# EAGLE design Power Board V3 (EAGLE 7.6.0)
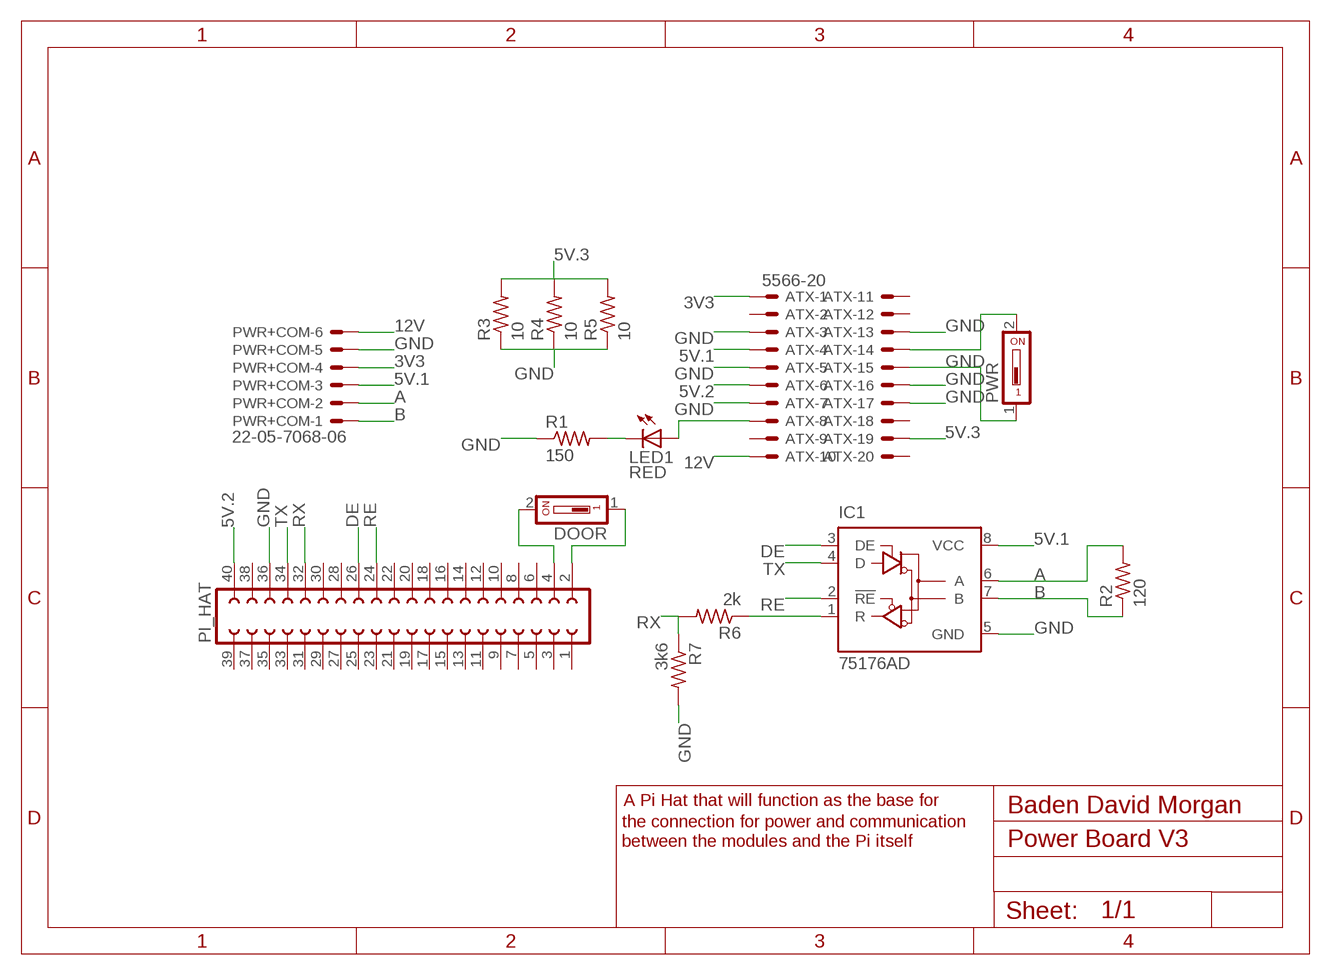
[diagram p0: schematic, sheet 1]

## Parts
ATX  5566-20  [5566-20]
DOOR  SD4-01  [SD4-01]
IC1  75176AD  [D_R-PDSO-G8]
LED1  RED  LEDCHIPLED_1206  [CHIPLED_1206]
PI_HAT  FE20-2  [FE20-2]
PWR  SD4-01  [SD4-01]
PWR+COM  22-05-7068-06  [7395-06]
R1  150  R-US_R0805  [R0805]
R2  120  R-US_R0805  [R0805]
R3  10  R-US_0817/7V  [P0817V]
R4  10  R-US_0817/7V  [P0817V]
R5  10  R-US_0817/7V  [P0817V]
R6  2k  R-US_R0805  [R0805]
R7  3k6  R-US_R0805  [R0805]

## Nets
3V3: ATX.1 PWR+COM.4
5V.1: ATX.4 IC1.8(VCC) PWR+COM.3
5V.2: ATX.6 PI_HAT.40
5V.3: ATX.19 R3.2 R4.2 R5.2
12V: ATX.10 PWR+COM.6
A: IC1.6(A) PWR+COM.2 R2.2
B: IC1.7(B) PWR+COM.1 R2.1
DE: IC1.3(DE) PI_HAT.26
GND: ATX.3 ATX.5 ATX.7 ATX.13 ATX.15 ATX.16 ATX.17 IC1.5(GND) PI_HAT.36 PWR+COM.5 PWR.1 R1.1 R3.1 R4.1 R5.1 R7.2
N$1: ATX.14 PWR.2
N$2: DOOR.2 PI_HAT.4
N$3: ATX.8 LED1.A
N$4: LED1.C R1.2
N$5: DOOR.1 PI_HAT.2
N$6: IC1.1(R) R6.1
RE: IC1.2(!RE) PI_HAT.24
RX: PI_HAT.32 R6.2 R7.1
TX: IC1.4(D) PI_HAT.34
Unconnected: ATX.2 ATX.9 ATX.11 ATX.12 ATX.18 ATX.20 PI_HAT.1 PI_HAT.3 PI_HAT.5 PI_HAT.6 PI_HAT.7 PI_HAT.8 PI_HAT.9 PI_HAT.10 PI_HAT.11 PI_HAT.12 PI_HAT.13 PI_HAT.14 PI_HAT.15 PI_HAT.16 PI_HAT.17 PI_HAT.18 PI_HAT.19 PI_HAT.20 PI_HAT.21 PI_HAT.22 PI_HAT.23 PI_HAT.25 PI_HAT.27 PI_HAT.28 PI_HAT.29 PI_HAT.30 PI_HAT.31 PI_HAT.33 PI_HAT.35 PI_HAT.37 PI_HAT.38 PI_HAT.39

## Notes on the sheet
- A Pi Hat that will function as the base for
- Baden David Morgan
- the connection for power and communication
- between the modules and the Pi itself

## Library data of the parts
ATX = con-molex:5566-20: Mini FIT connector 20 pol ATX PC-Motherboard Power connector Source: http://www.molex.com; OC_FARNELL: unknown; OC_NEWARK: unknown
DOOR PWR = switch-dil:SD4-01: DIL/CODE SWITCH; OC_FARNELL: unknown; OC_NEWARK: unknown
IC1 = 751xx:75176A: DIFFERENTIAL BUS TRANSCEIVER Source: http://focus.ti.com/lit/ds/symlink/sn75176a.pdf
LED1 = led:LED: LED OSRAM: - CHIPLED LG R971, LG N971, LY N971, LG Q971, LY Q971, LO R971, LY R971 LH N974, LH R974 LS Q976, LO Q976, LY Q976 LO Q996 - Hyper CHIPLED LW Q18S LB Q993, LB Q99A, LB R99A - SideLED LS A670, LO A670, LY A670, LG A670, LP A670 LB A673, LV A673, LT A673, LW A673 LH A674 LY A675 LS A676, LA A676, LO A676, LY A676, LW A676 LS A679, LY A679, LG A679 - Hyper Micro SIDELED® LS Y876, LA Y876, LO Y876, LY Y876 LT Y87S - SmartLED LW L88C, LW L88S LB L89C, LB L89S, LG L890 LS L89K, LO L89K, LY L89K LS L896, LA L896, LO L896, LY L896 - TOPLED LS T670, LO T670, LY T670, LG T670, LP T670 LSG T670, LSP T670, LSY T670, LOP T670, LYG T670 LG T671, LOG T671, LSG T671 LB T673, LV T673, LT T673, LW T673 LH T674 LS T676, LA T676, LO T676, LY T676, LB T676, LH T676, LSB T676, LW T676 LB T67C, LV T67C, LT T67C, LS T67K, LO T67K, LY T67K, LW E67C LS E67B, LA E67B, LO E67B, LY E67B, LB E67C, LV E67C, LT E67C LW T67C LS T679, LY T679, LG T679 LS T770, LO T770, LY T770, LG T770, LP T770 LB T773, LV T773, LT T773, LW T773 LH T774 LS E675, LA E675, LY E675, LS T675 LS T776, LA T776, LO T776, LY T776, LB T776 LHGB T686 LT T68C, LB T68C - Hyper Mini TOPLED® LB M676 - Mini TOPLED Santana® LG M470 LS M47K, LO M47K, LY M47K Source: http://www.osram.convergy.de LUXEON: - LUMILED® LXK2-PW12-R00, LXK2-PW12-S00, LXK2-PW14-U00, LXK2-PW14-V00 LXK2-PM12-R00, LXK2-PM12-S00, LXK2-PM14-U00 LXK2-PE12-Q00, LXK2-PE12-R00, LXK2-PE12-S00, LXK2-PE14-T00, LXK2-PE14-U00 LXK2-PB12-K00, LXK2-PB12-L00, LXK2-PB12-M00, LXK2-PB14-N00, LXK2-PB14-P00, LXK2-PB14-Q00 LXK2-PR12-L00, LXK2-PR12-M00, LXK2-PR14-Q00, LXK2-PR14-R00 LXK2-PD12-Q00, LXK2-PD12-R00, LXK2-PD12-S00 LXK2-PH12-R00, LXK2-PH12-S00 LXK2-PL12-P00, LXK2-PL12-Q00, LXK2-PL12-R00 Source: www.luxeon.com KINGBRIGHT: KA-3528ASYC Source: www.kingbright.com
PI_HAT = con-lsta:FE20-2: FEMALE HEADER; OC_FARNELL: unknown; OC_NEWARK: unknown
PWR+COM = con-molex:22-?-06: CONNECTOR wire to board 2.54 mm (.1 inch) pitch header; OC_FARNELL: unknown; OC_NEWARK: unknown
R1 R2 R6 R7 = resistor:R-US_: RESISTOR, American symbol
R3-R5 = rcl:R-US_: RESISTOR, American symbol

## Board
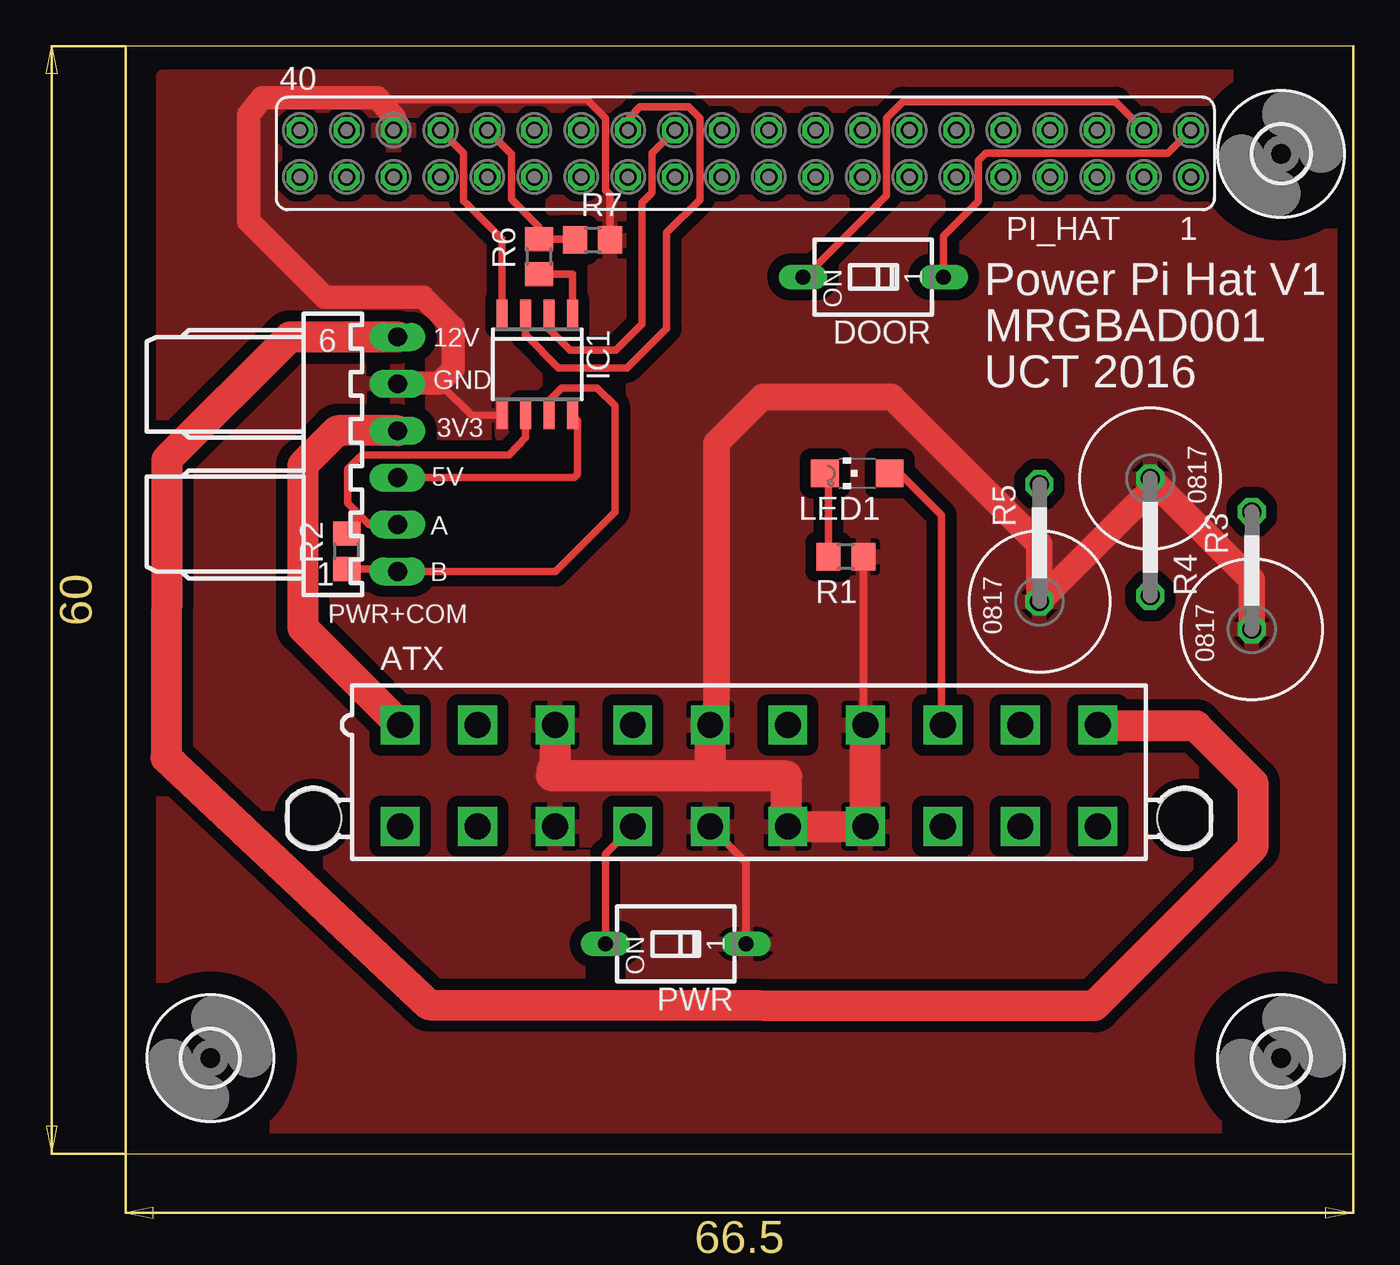
[diagram p1: board, top side]
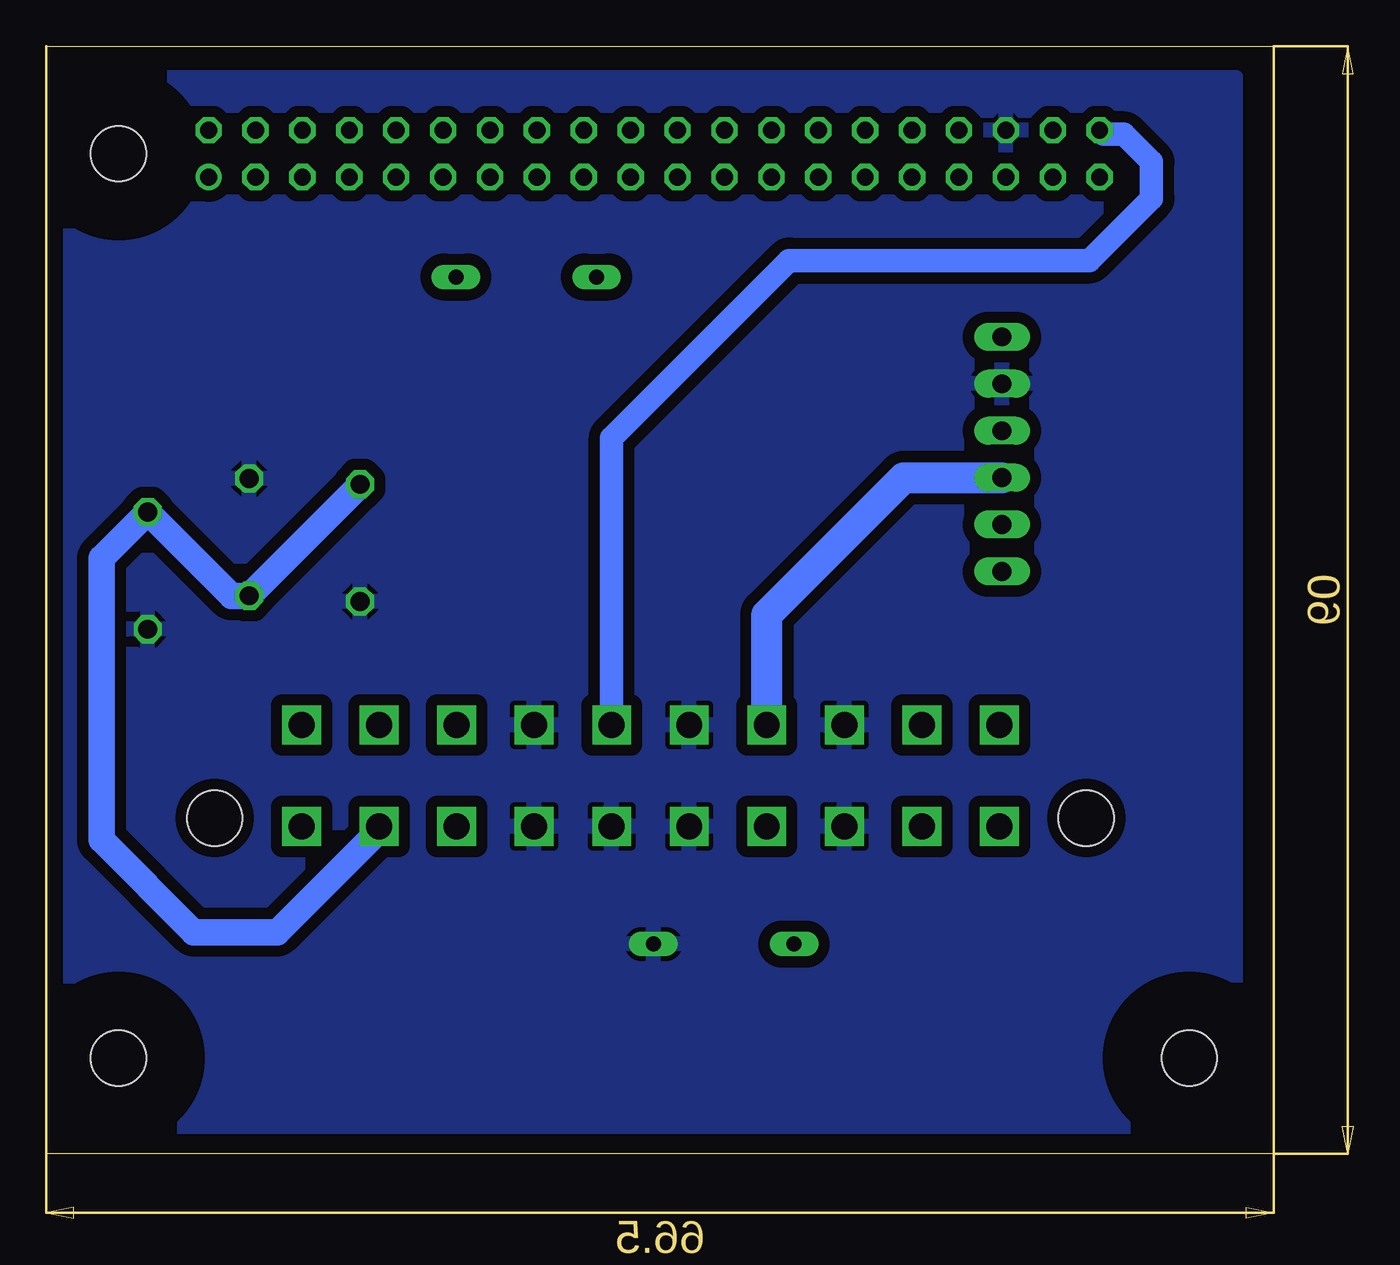
[diagram p2: board, bottom side, seen from below]

Size 66.5 x 60 mm. Coordinates in mm from the lower left corner, seen from the top.
Outline: 0,0 66.5,0 66.5,60 0,60 0,0
Copper layers (1*16): Top 0.035mm / dielectric 1.5mm / Bottom 0.035mm
Design rules "trax_discount_template": minimum track width 10mil, minimum drill 0.3mm, track to track 0.25mm, track to pad 0.25mm, pad to pad 0.25mm, via to via 0.25mm, smd to smd 0.25mm, copper to edge 0.5mm, drill to drill 0.35mm, minimum pad ring 10mil, minimum via ring 8mil, stop-mask expansion 4mil, vias tented up to drill 0mil, thermal gap 10mil

### Footprints (pad centres in the part's own frame; a part is rotated, then mirrored left to right if it is on the bottom)
5566-20 = drill 1.4 square: 1 18.9,-2.75; 2 14.7,-2.75; 3 10.5,-2.75; 4 6.3,-2.75; 5 2.1,-2.75; 6 -2.1,-2.75; 7 -6.3,-2.75; 8 -10.5,-2.75; 9 -14.7,-2.75; 10 -18.9,-2.75; 11 18.9,2.75; 12 14.7,2.75; 13 10.5,2.75; 14 6.3,2.75; 15 2.1,2.75; 16 -2.1,2.75; 17 -6.3,2.75; 18 -10.5,2.75; 19 -14.7,2.75; 20 -18.9,2.75 | hole 3: 23.6,2.29; -23.6,2.29
SD4-01 = drill 0.813 long: 1 0,-3.81; 2 0,3.81
D_R-PDSO-G8 = smd 0.6 x 1.5: 1 -1.905,-2.75; 2 -0.635,-2.75; 3 0.635,-2.75; 4 1.905,-2.75; 5 1.905,2.75; 6 0.635,2.75; 7 -0.635,2.75; 8 -1.905,2.75
CHIPLED_1206 = smd 1.5 x 1.5: A 0,-1.75; C 0,1.75
FE20-2 = drill 0.914: 1 -24.13,1.27 | drill 0.914 octagon: 2 -24.13,-1.27; 3 -21.59,1.27; 4 -21.59,-1.27; 5 -19.05,1.27; 6 -19.05,-1.27; 7 -16.51,1.27; 8 -16.51,-1.27; 9 -13.97,1.27; 10 -13.97,-1.27; 11 -11.43,1.27; 12 -11.43,-1.27; 13 -8.89,1.27; 14 -8.89,-1.27; 15 -6.35,1.27; 16 -6.35,-1.27; 17 -3.81,1.27; 18 -3.81,-1.27; 19 -1.27,1.27; 20 -1.27,-1.27; 21 1.27,1.27; 22 1.27,-1.27; 23 3.81,1.27; 24 3.81,-1.27; 25 6.35,1.27; 26 6.35,-1.27; 27 8.89,1.27; 28 8.89,-1.27; 29 11.43,1.27; 30 11.43,-1.27; 31 13.97,1.27; 32 13.97,-1.27; 33 16.51,1.27; 34 16.51,-1.27; 35 19.05,1.27; 36 19.05,-1.27; 37 21.59,1.27; 38 21.59,-1.27; 39 24.13,1.27; 40 24.13,-1.27
7395-06 = drill 1.016 long: 1 6.35,0; 2 3.81,0; 3 1.27,0; 4 -1.27,0; 5 -3.81,0; 6 -6.35,0
R0805 = smd 1.3 x 1.5: 1 -0.95,0; 2 0.95,0
P0817V = drill 1.016 octagon: 1 -5.08,0; 2 1.27,0
3,0 = hole 3: 0,0

### Placement (x,y rotation side)
ATX  33.77,20.48 180 top
DOOR  40.5,47.5 90 top
IC1  22.3,42.76 180 top
LED1  39.63,36.86 90 top
PI_HAT  33.57,54.18 180 top
PWR  29.8,11.37 90 top
PWR+COM  14.73,37.9 270 top
R1  39.01,32.35 180 top
R2  11.98,32.64 90 top
R3  61,33.5 90 top
R4  55.5,31.5 270 top
R5  49.5,35 90 top
R6  22.4,48.6 90 top
R7  25.3,49.5 0 top
U$1  [3,0]  62.59,54.17 0 top
U$2  [3,0]  62.59,5.19 0 top
U$3  [3,0]  4.59,5.19 0 top

### Tracks (layer width: path | path; a pad name or v marks a point on that pad's centre or on a via)
3V3
  Top 1.676: PWR+COM.4 11.46,39.17 9.6,37.31 9.6,28.5 ATX.1
5V.1
  Top 0.406: PWR+COM.3 24.29,36.63 24.49,36.83 24.49,39.73 IC1.8
  Bottom 1.676: ATX.4 27.47,29.21 20.05,36.63 PWR+COM.3
5V.2
  Bottom 1.27: ATX.6 35.87,38.78 26.26,48.39 9.99,48.39 6.64,51.74 6.64,53.74 8.12,55.22 9.21,55.22 PI_HAT.40
5V.3
  Bottom 1.422: R5.2 49.5,36.23 R4.2 56.46,30.23 R3.2 63.5,32.27 63.5,17 58.5,12 54,12 48.47,17.53 ATX.19
12V
  Top 1.676: PWR+COM.6 8.89,44.25 2.24,37.6 2.19,21.47 16.43,8.08 52.48,8.03 61.08,16.63 61.08,20.07 57.97,23.18 52.72,23.18 ATX.10
A
  Top 0.406: PWR+COM.2 13.2,34.09 12.46,34.83 | 12.46,34.83 12.04,35.25 12.04,37.09 12.71,37.76 12.71,37.78 12.83,37.86 20.77,37.86 21.67,38.8 IC1.6 | R2.2 12.46,33.59 12.46,34.83
B
  Top 0.406: IC1.7 22.93,40.8 23.61,41.48 25.55,41.48 26.51,40.52 26.51,34.77 23.28,31.54 PWR+COM.1 14.73,31.69 R2.1
DE
  Top 0.406: IC1.3 21.66,44.37 23.46,42.57 27.16,42.57 29.3,44.71 29.3,49.89 31.1,51.69 31.1,56.09 30.48,56.71 27.87,56.71 27.26,56.1 27.26,55.49 PI_HAT.26
GND
  Top 0.406: IC1.5 18.73,40.01 16.99,41.75 | R1.1 39.96,23.34 ATX.7 | PWR.1 33.61,15.79 ATX.15 | R7.2 26.25,51.95 26,52.2 26,56.1 25,57.1 13.75,57.1 13.74,57.09
  Top 0.813: 14.77,41.75 PWR+COM.5
  Top 1.27: 14.77,41.75 16.99,41.75 17.74,42.5 17.74,44.78 16.11,46.41 10.78,46.41 6.68,50.51 6.68,56.28 7.39,57.22 13.63,57.22 13.74,57.09 14.54,56.16 14.54,55.47 PI_HAT.36
  Top 1.422: R3.1 61,31.08 R4.1 55.5,35.92 R5.1 49.5,33 41.5,41 34.5,41 32,38.5 32,23.56 ATX.5
  Top 1.676: ATX.3 23.27,20.99 23.11,20.83 23.11,20.54 23.06,20.49 31.67,20.49 | 31.67,20.49 ATX.5 | 31.67,20.49 31.67,20.46 35.8,20.46 35.8,17.73 ATX.16 ATX.17 ATX.7
  pour Top (isolate 0.61): 2.06,58.35 65.21,58.35 65.21,1.49 2.06,1.49
  pour Bottom (isolate 0.61): 2.06,58.3 65.2,58.3 65.2,1.49 2.06,1.49
N$1
  Top 0.406: PWR.2 25.99,16.25 ATX.14
N$2
  Top 0.406: DOOR.2 36.8,47.5 41.2,51.9 41.2,56.1 42.1,57 53.61,57 PI_HAT.4
N$3
  Top 0.406: LED1.A 41.93,36.86 44.2,34.59 44.2,23.3 ATX.8
N$4
  Top 0.406: R1.2 38.06,36.68 LED1.C
N$5
  Top 0.406: DOOR.1 44.31,49.71 46.2,51.6 46.2,53.8 46.6,54.2 56.45,54.2 PI_HAT.2
N$6
  Top 0.406: R6.1 24.2,47.65 IC1.1
RE
  Top 0.406: IC1.2 22.93,44.69 24.08,43.54 26.57,43.54 27.97,44.94 27.97,51.51 28.43,51.97 28.43,51.99 28.52,52.08 28.52,54.22 PI_HAT.24
RX
  Top 0.406: R7.1 24.35,49.55 R6.2 22.4,50.2 20.9,51.7 20.9,54.15 PI_HAT.32
TX
  Top 0.406: IC1.4 20.39,49.55 18.47,51.47 18.46,51.47 18.32,51.61 18.32,54.21 18.3,54.21 PI_HAT.34

### Text on the board
tPlace: 12V | GND | 3V3 | 5V | A | B
tNames: Power Pi Hat V1 | MRGBAD001 | UCT 2016